# EAGLE design 4550 BOARD 1 (EAGLE 5.08)
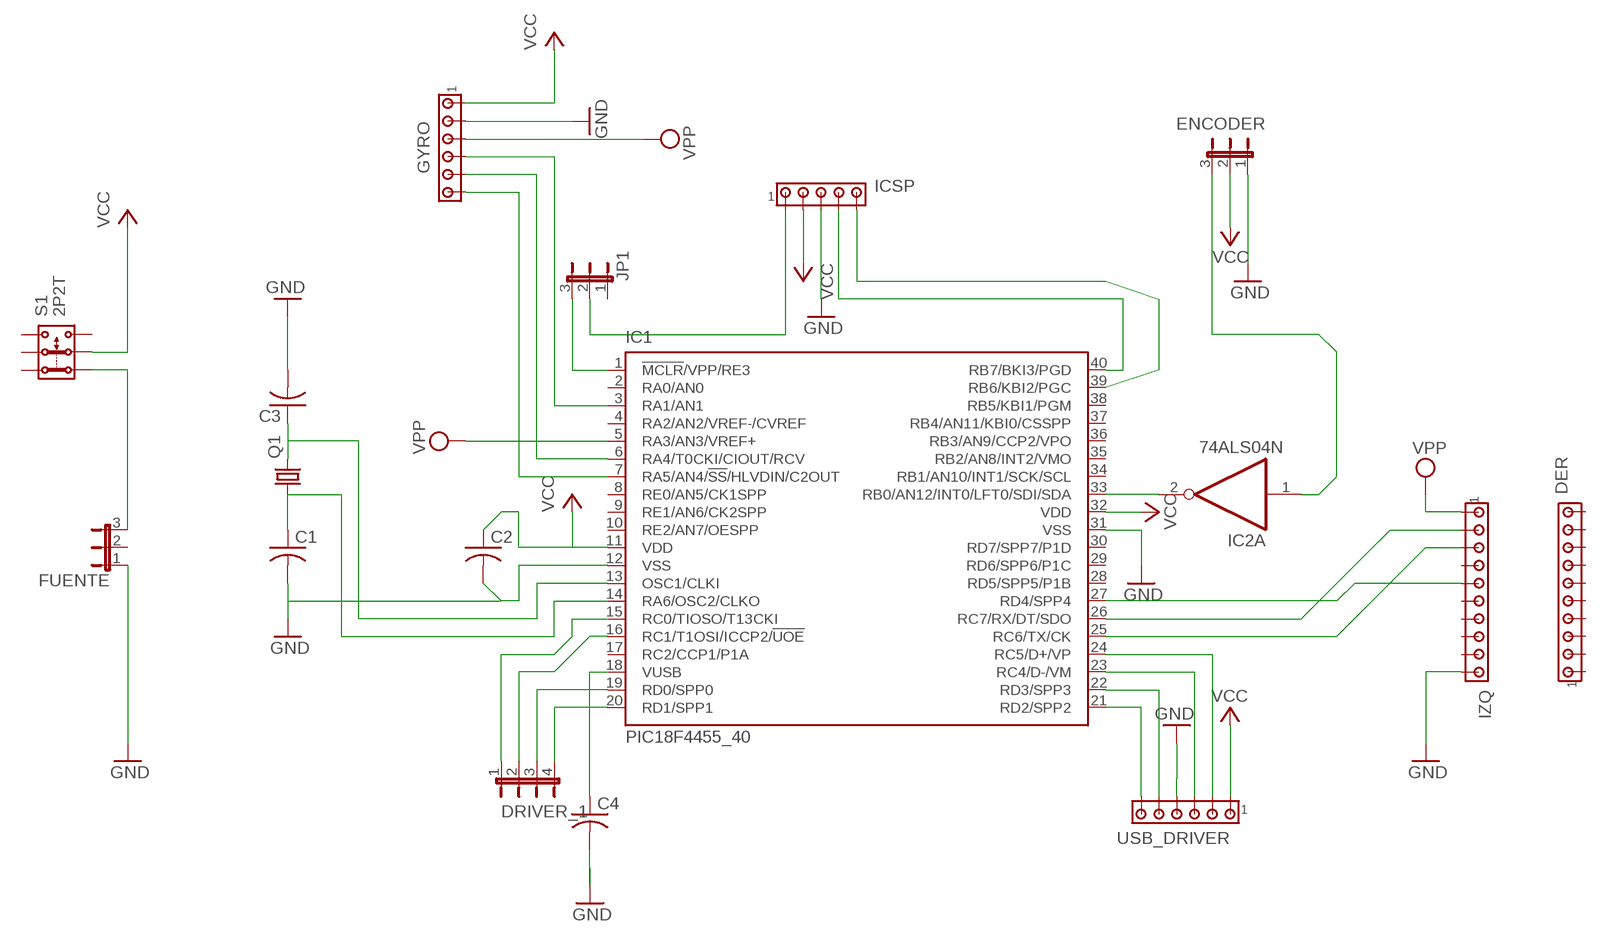
[diagram p0: schematic, sheet 1]

## Parts
C1  C-US025-024X044  [C025-024X044]
C2  C-US025-024X044  [C025-024X044]
C3  C-US025-024X044  [C025-024X044]
C4  C-US025-024X044  [C025-024X044]
DER  MTA10-100  [10X10MTA]
DRIVER_1  JP4E  [JP4]
ENCODER  JP2E  [JP2]
FUENTE  JP2E  [JP2]
GYRO  MTA06-100  [10X06MTA]
IC1  PIC18F4455_40  [DIL40]
IC2  74ALS04N  [DIL14]
ICSP  MTA05-100  [10X05MTA]
IZQ  MTA10-100  [10X10MTA]
JP1  JP2E  [JP2]
Q1  CRYSTALHC49S  [HC49/S]
S1  2P2T  [2P2T]
USB_DRIVER  MTA06-100  [10X06MTA]

## Nets
GND: C1.2 C2.2 C3.2 C4.2 ENCODER.1 FUENTE.1 GYRO.5 IC1.12(VSS) IC1.31(VSS) ICSP.3 IZQ.10 USB_DRIVER.3
N$1: FUENTE.3 S1.1.2
N$2: C3.1 IC1.13(OSC1/CLKI) Q1.2
N$3: C1.1 IC1.14(RA6/OSC2/CLKO) Q1.1
N$7: GYRO.3 IC1.3(RA1/AN1)
N$8: GYRO.2 IC1.6(RA4/T0CKI/CIOUT/RCV)
N$9: GYRO.1 IC1.7(RA5/AN4/!SS!/HLVDIN/C2OUT)
N$10: IC1.1(!MCLR!/VPP/RE3) JP1.3
N$11: ICSP.1 JP1.2
N$12: IC1.40(RB7/BKI3/PGD) ICSP.4
N$13: IC1.39(RB6/KBI2/PGC) ICSP.5
N$14: IC1.33(RB0/AN12/INT0/LFT0/SDI/SDA) IC2.2(A:O)
N$15: ENCODER.3 IC2.1(A:I)
N$16: DRIVER_1.1 IC1.15(RC0/TIOSO/T13CKI)
N$17: DRIVER_1.2 IC1.16(RC1/T1OSI/ICCP2/!UOE)
N$18: DRIVER_1.3 IC1.19(RD0/SPP0)
N$19: DRIVER_1.4 IC1.20(RD1/SPP1)
N$20: C4.1 IC1.18(VUSB)
N$21: IC1.21(RD2/SPP2) USB_DRIVER.1
N$22: IC1.22(RD3/SPP3) USB_DRIVER.2
N$23: IC1.23(RC4/D-/VM) USB_DRIVER.4
N$24: IC1.24(RC5/D+/VP) USB_DRIVER.5
N$25: IC1.26(RC7/RX/DT/SDO) IZQ.2
N$26: IC1.25(RC6/TX/CK) IZQ.3
N$27: IC1.27(RD4/SPP4) IZQ.5
VCC: C2.1 ENCODER.2 GYRO.6 IC1.11(VDD) IC1.32(VDD) ICSP.2 S1.2.2 USB_DRIVER.6
VPP: GYRO.4 IC1.5(RA3/AN3/VREF+) IZQ.1
Unconnected: DER.1 DER.2 DER.3 DER.4 DER.5 DER.6 DER.7 DER.8 DER.9 DER.10 FUENTE.2 IC1.2(RA0/AN0) IC1.4(RA2/AN2/VREF-/CVREF) IC1.8(RE0/AN5/CK1SPP) IC1.9(RE1/AN6/CK2SPP) IC1.10(RE2/AN7/OESPP) IC1.17(RC2/CCP1/P1A) IC1.28(RD5/SPP5/P1B) IC1.29(RD6/SPP6/P1C) IC1.30(RD7/SPP7/P1D) IC1.34(RB1/AN10/INT1/SCK/SCL) IC1.35(RB2/AN8/INT2/VMO) IC1.36(RB3/AN9/CCP2/VPO) IC1.37(RB4/AN11/KBI0/CSSPP) IC1.38(RB5/KBI1/PGM) IC2.3(B:I) IC2.4(B:O) IC2.5(C:I) IC2.6(C:O) IC2.8(D:O) IC2.9(D:I) IC2.10(E:O) IC2.11(E:I) IC2.12(F:O) IC2.13(F:I) IZQ.4 IZQ.6 IZQ.7 IZQ.8 IZQ.9 JP1.1 S1.1.1 S1.2.1 S1.3.1 S1.3.2

## Power pins joined to a net without a drawn wire
GND: IC2.7(P:GND)
VCC: IC2.14(P:VCC)

## Library data of the parts
C1-C4 = rcl:C-US: CAPACITOR, American symbol
DER IZQ = con-amp:MTA10-100: AMP connector
DRIVER_1 = jumper:JP4E: JUMPER
ENCODER FUENTE JP1 = jumper:JP2E: JUMPER
GYRO USB_DRIVER = con-amp:MTA06-100: AMP connector
IC1 = microchip:PIC18F4*_40: USB Microcontrollers with nanoWatt Technology High-Performance, Enhanced Flash, 28/40/44-Pin, Source: http://ww1.microchip.com/downloads/en/devicedoc/39632c.pdf
IC2 = 74xx-eu:74*04: Hex INVERTER
ICSP = con-amp:MTA05-100: AMP connector
Q1 = crystal:CRYSTAL: CRYSTAL
S1 = switch:2P2T: SLIDE SWITCH 2P2T Part No. SS-22F05-G(A)4 Source: CANAL ELECTRONIC CO., LTD .. switsch.pdf

## Board
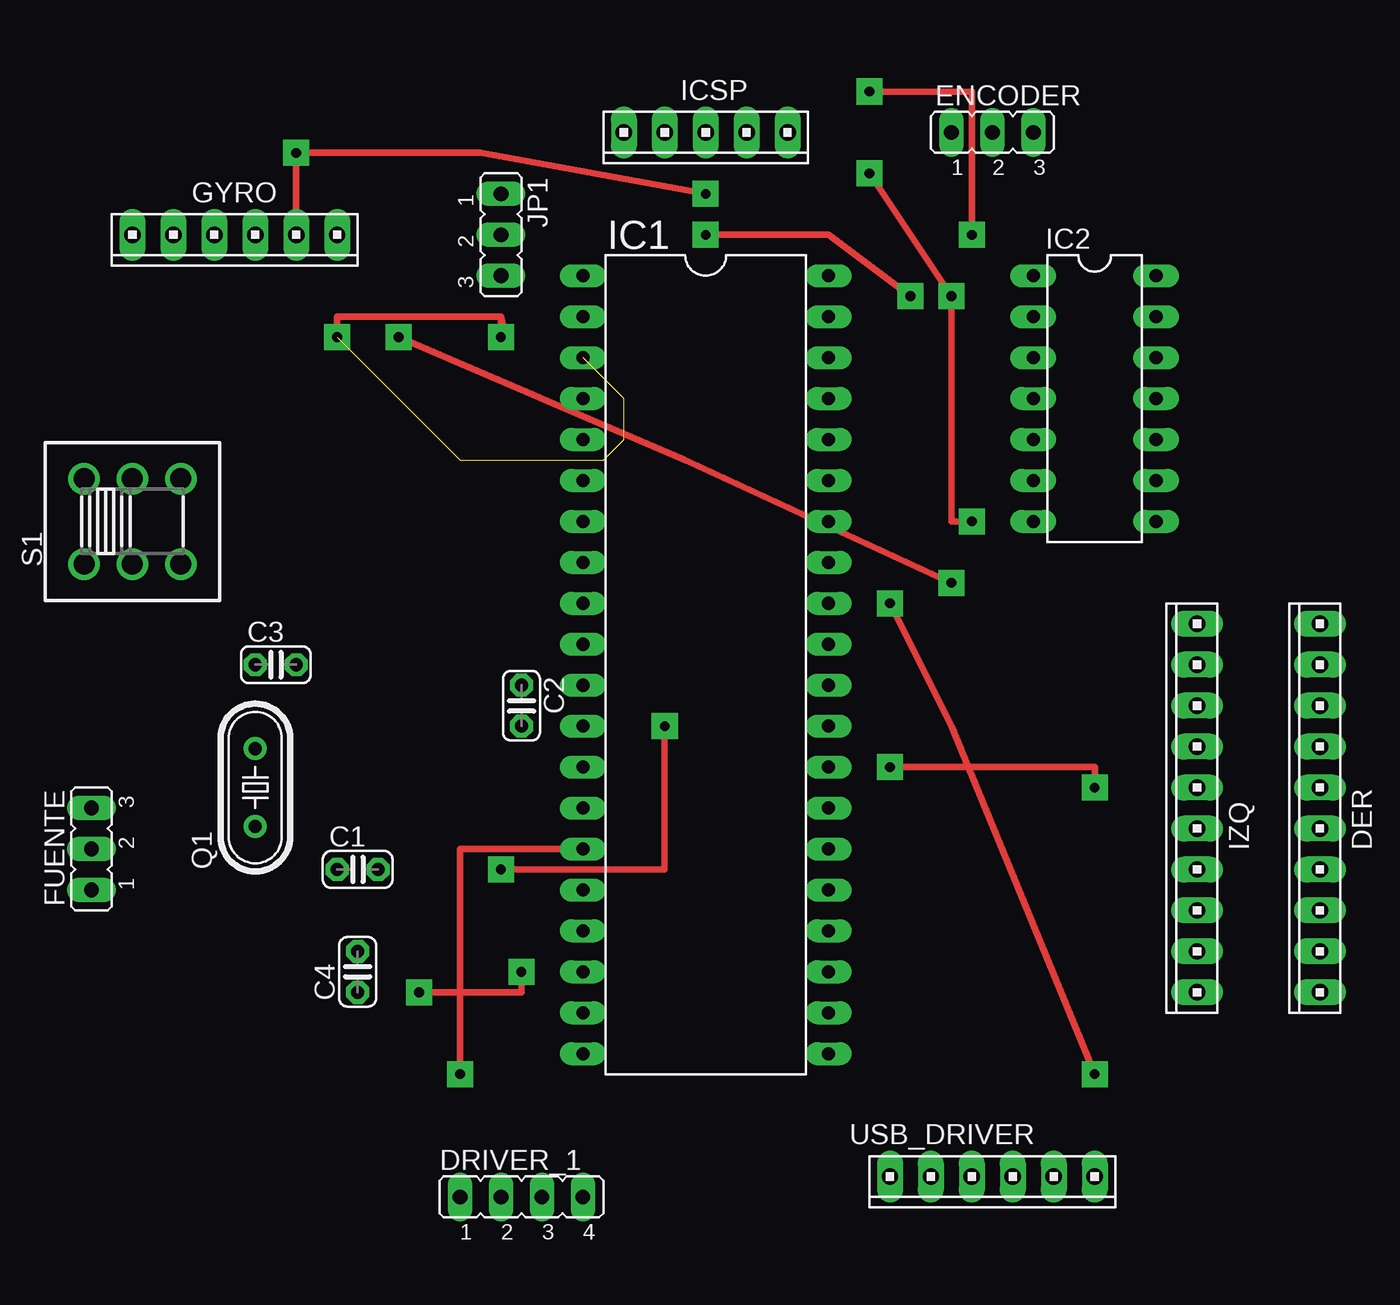
[diagram p1: board, top side]
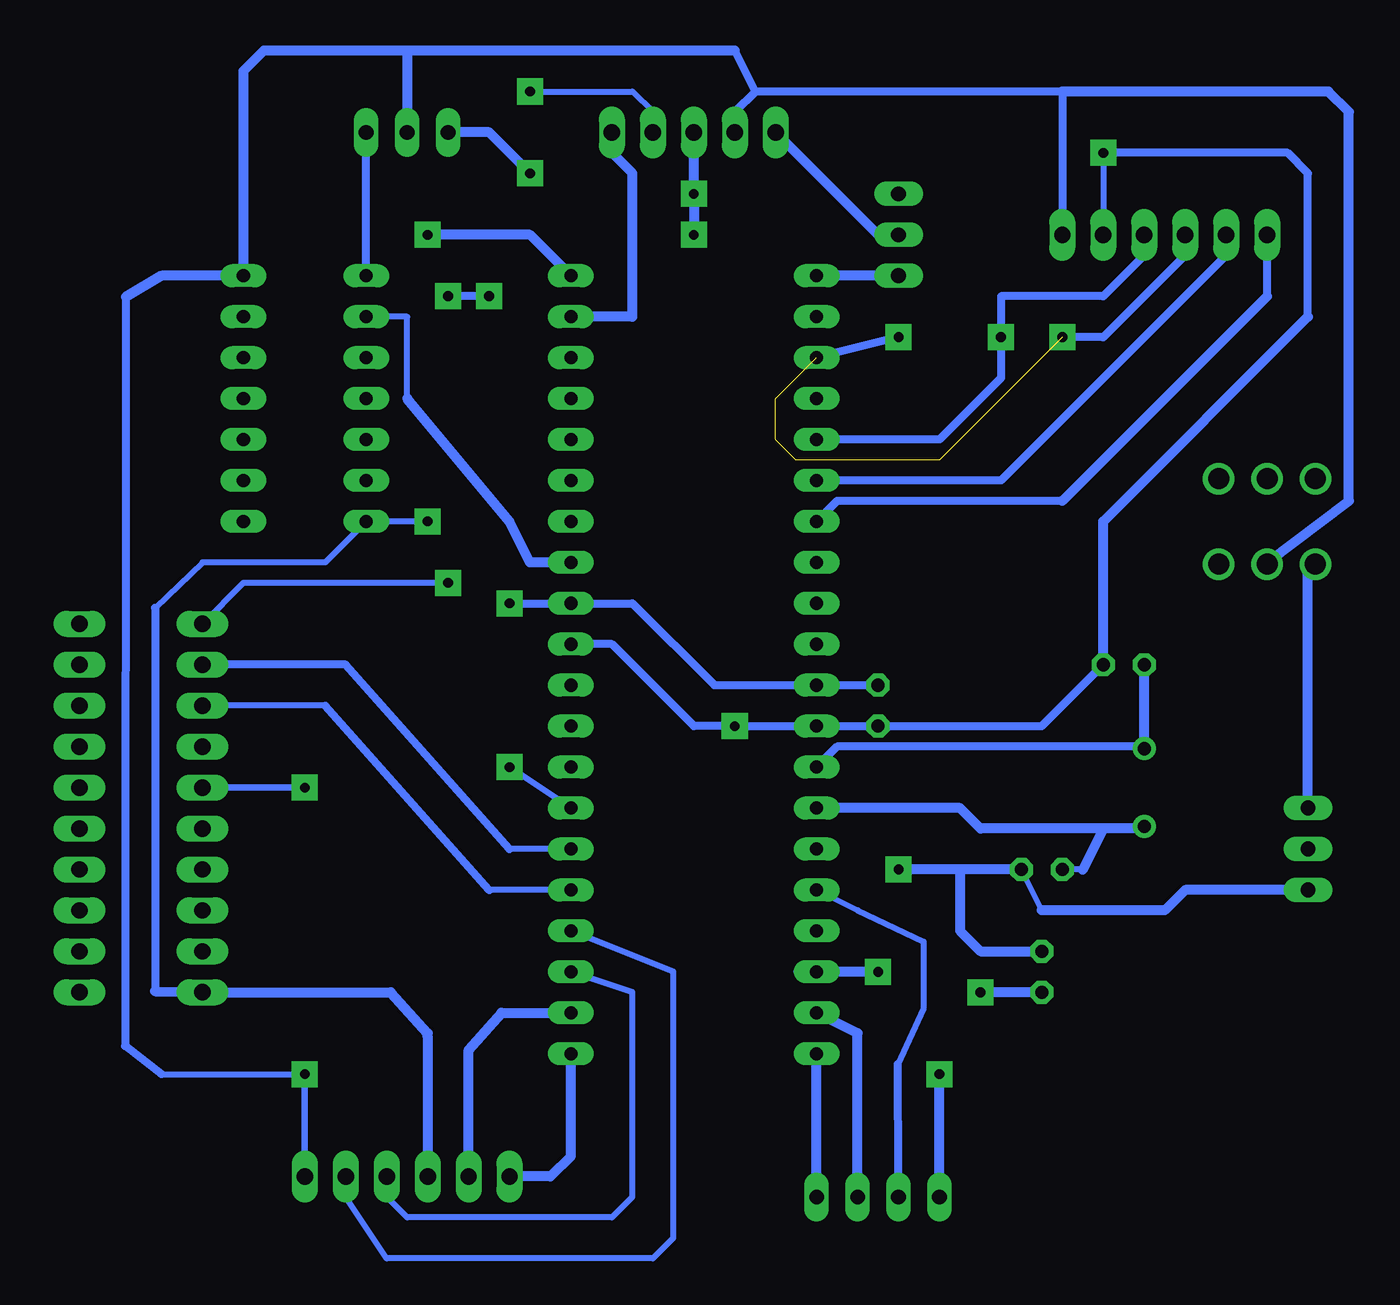
[diagram p2: board, bottom side, seen from below]

No outline drawn. Coordinates in mm, seen from the top.
Copper layers (1*16): Top 0.035mm / dielectric 1.5mm / Bottom 0.035mm
Design rules "Pcb close *": minimum track width 20mil, minimum drill 24mil, track to track 15mil, track to pad 12mil, pad to pad 12mil, via to via 8mil, smd to smd 8mil, copper to edge 40mil, drill to drill 8mil, minimum pad ring 12mil, minimum via ring 20mil, stop-mask expansion 4mil, vias tented up to drill 0mil, thermal gap 10mil

### Footprints (pad centres in the part's own frame; a part is rotated, then mirrored left to right if it is on the bottom)
C025-024X044 = drill 0.813 octagon: 1 -1.27,0; 2 1.27,0
10X10MTA = drill 1.016 long: 1 11.43,0; 2 8.89,0; 3 6.35,0; 4 3.81,0; 5 1.27,0; 6 -1.27,0; 7 -3.81,0; 8 -6.35,0; 9 -8.89,0; 10 -11.43,0
JP4 = drill 0.914 long: 1 -3.81,0; 2 -1.27,0; 3 1.27,0; 4 3.81,0
JP2 = drill 0.914 long: 1 -2.54,0; 2 0,0; 3 2.54,0
10X06MTA = drill 1.016 long: 1 6.35,0; 2 3.81,0; 3 1.27,0; 4 -1.27,0; 5 -3.81,0; 6 -6.35,0
DIL40 = drill 0.813 long: 1 -24.13,-7.62; 2 -21.59,-7.62; 3 -19.05,-7.62; 4 -16.51,-7.62; 5 -13.97,-7.62; 6 -11.43,-7.62; 7 -8.89,-7.62; 8 -6.35,-7.62; 9 -3.81,-7.62; 10 -1.27,-7.62; 11 1.27,-7.62; 12 3.81,-7.62; 13 6.35,-7.62; 14 8.89,-7.62; 15 11.43,-7.62; 16 13.97,-7.62; 17 16.51,-7.62; 18 19.05,-7.62; 19 21.59,-7.62; 20 24.13,-7.62; 21 24.13,7.62; 22 21.59,7.62; 23 19.05,7.62; 24 16.51,7.62; 25 13.97,7.62; 26 11.43,7.62; 27 8.89,7.62; 28 6.35,7.62; 29 3.81,7.62; 30 1.27,7.62; 31 -1.27,7.62; 32 -3.81,7.62; 33 -6.35,7.62; 34 -8.89,7.62; 35 -11.43,7.62; 36 -13.97,7.62; 37 -16.51,7.62; 38 -19.05,7.62; 39 -21.59,7.62; 40 -24.13,7.62
DIL14 = drill 0.813 long: 1 -7.62,-3.81; 2 -5.08,-3.81; 3 -2.54,-3.81; 4 0,-3.81; 5 2.54,-3.81; 6 5.08,-3.81; 7 7.62,-3.81; 8 7.62,3.81; 9 5.08,3.81; 10 2.54,3.81; 11 0,3.81; 12 -2.54,3.81; 13 -5.08,3.81; 14 -7.62,3.81
10X05MTA = drill 1.016 long: 1 5.08,0; 2 2.54,0; 3 0,0; 4 -2.54,0; 5 -5.08,0
HC49/S = drill 0.813 round: 1 -2.413,0; 2 2.413,0
2P2T = drill 1.3 pad 1.93 round: 1.1 -3,2.65; 1.2 -3,-2.65; 2.1 0,2.65; 2.2 0,-2.65; 3.1 3,2.65; 3.2 3,-2.65

### Placement (x,y rotation side)
C1  41.91,24.13 0 top
C2  52.07,34.29 270 top
C3  36.83,36.83 0 top
C4  41.91,17.78 90 top
DER  101.6,27.94 90 top
DRIVER_1  52.07,3.81 0 top
ENCODER  81.28,69.85 0 top
FUENTE  25.4,25.4 90 top
GYRO  34.29,63.5 180 top
IC1  63.5,36.83 270 top
IC2  87.63,53.34 270 top
ICSP  63.5,69.85 180 top
IZQ  93.98,27.94 90 top
JP1  50.8,63.5 270 top
Q1  35.56,29.21 90 top
S1  27.94,45.72 0 top
USB_DRIVER  81.28,5.08 180 top

### Tracks (layer width: path | path; a pad name or v marks a point on that pad's centre or on a via)
GND  (via drill 0.6)
  Top 0.406: GYRO.5 v38.1,68.58 49.53,68.58 v63.5,66.04 | v63.5,63.5 71.12,63.5 v76.2,59.69 | v73.66,67.31 v78.74,59.69 78.74,45.72 v80.01,45.72 | v50.8,24.13 60.96,24.13 v60.96,33.02
  Bottom 0.381: 41.91,21.59 C1.2 | 96.91,40.35 93.98,43.18 86.36,43.18 IC2.7 v80.01,45.72 | v38.1,68.58 GYRO.5
  Bottom 0.508: C3.2 41.91,33.02 C2.2 IC1.12 v60.96,33.02 63.5,33.02 68.58,38.1 IC1.31 | 96.91,40.35 96.91,16.58 | v76.2,59.69 v78.74,59.69 | 25.4,58.42 25.4,67.31 26.67,68.58 v38.1,68.58
  Bottom 0.61: C4.2 45.72,19.05 46.99,20.32 46.99,24.13 | C1.2 46.99,24.13 | 46.99,24.13 v50.8,24.13 | FUENTE.1 33.02,22.86 34.29,21.59 41.91,21.59 | ICSP.3 v63.5,66.04 v63.5,63.5 | 96.91,16.58 IZQ.10 82.3,16.51 80.01,13.97 80.01,13.72 USB_DRIVER.3 | v73.66,67.31 76.2,69.85 ENCODER.1 | C3.2 38.1,45.72 25.4,58.42
N$1
  Bottom 0.381: 25.4,43.18 S1.1.2
  Bottom 0.61: FUENTE.3 25.4,43.18
N$2
  Bottom 0.381: Q1.2 35.56,31.75
  Bottom 0.508: IC1.13 54.61,31.75 35.56,31.75
  Bottom 0.61: 35.56,31.75 C3.1
N$3
  Bottom 0.381: 39.37,24.13 C1.1 | Q1.1 35.56,26.67
  Bottom 0.61: 38.1,26.67 39.37,24.13 | 35.56,26.67 38.1,26.67 | IC1.14 46.99,27.94 45.72,26.67 38.1,26.67
N$4  (via drill 0.6)
  other vias: 74.93,30.48
N$5  (via drill 0.6)
  other vias: 87.63,29.21
N$6  (via drill 0.6)
  other vias: 48.26,11.43
N$7  (via drill 0.6)  (5 unrouted)
  Top 0.406: v40.64,57.15 40.64,58.42 50.8,58.42 | 50.8,58.42 51.1,57.15 51.1,57.08 50.8,57.08 50.8,58.42
  Bottom 0.508: 50.8,57.15 IC1.3 | v40.64,57.15 38.1,57.15 33.02,62.23 GYRO.3
N$8
  Bottom 0.508: GYRO.2 30.48,62.23 44.45,48.26 IC1.6
N$9
  Bottom 0.508: IC1.7 54.61,46.99 40.64,46.99 | 27.94,59.69 GYRO.1
  Bottom 0.61: 27.94,59.69 40.64,46.99
N$10
  Bottom 0.61: JP1.3 IC1.1
N$11
  Bottom 0.381: JP1.2 52.07,63.5
  Bottom 0.61: 52.07,63.5 ICSP.1
N$12  (via drill 0.6)
  Top 0.406: v73.66,72.39 80.01,72.39 v80.01,63.5
  Bottom 0.381: v73.66,72.39 67.31,72.39 66.04,71.12 ICSP.4
  Bottom 0.61: IC1.40 73.66,63.5 v80.01,63.5
N$13
  Bottom 0.381: 68.58,68.58 ICSP.5
  Bottom 0.61: IC1.39 67.31,58.42 67.31,67.31 68.58,68.58
N$14
  Bottom 0.381: 81.28,53.34 81.28,58.42 IC2.2
  Bottom 0.61: IC1.33 73.66,43.18 74.93,45.72 81.28,53.34
N$15
  Bottom 0.508: IC2.1 ENCODER.3
N$16  (via drill 0.6)
  Top 0.406: v48.26,11.43 48.26,25.4 IC1.15
  Bottom 0.61: DRIVER_1.1 v48.26,11.43
N$17
  Bottom 0.381: IC1.16 53.34,21.59 49.23,19.65 arc90 49.23,19.64 49.23,15.55 50.84,12.05 | DRIVER_1.2 50.8,5.08
  Bottom 0.508: 50.8,5.08 50.84,12.05
N$18
  Bottom 0.61: IC1.19 53.34,13.97 DRIVER_1.3
N$19
  Bottom 0.61: DRIVER_1.4 IC1.20
N$20  (via drill 0.6)
  Top 0.406: v45.72,16.51 52.07,16.51 v52.07,17.78
  Bottom 0.381: IC1.18 57.15,17.78
  Bottom 0.61: C4.1 v45.72,16.51 | v52.07,17.78 IC1.18
N$21
  Bottom 0.61: IC1.21 71.12,6.35 72.39,5.08 USB_DRIVER.1
N$22
  Bottom 0.61: IC1.22 75.44,15.24 77.47,12.95 USB_DRIVER.2
N$23
  Bottom 0.381: IC1.23 67.31,16.51 67.31,3.81 68.58,2.54 81.28,2.54 82.55,3.81 USB_DRIVER.4
N$24
  Bottom 0.381: IC1.24 64.77,17.78 64.77,1.27 66.04,0 82.55,0 85.09,3.81 USB_DRIVER.5
N$25
  Bottom 0.381: IC1.26 74.93,25.4
  Bottom 0.508: 74.93,25.4 85.09,36.83 IZQ.2
N$26
  Bottom 0.381: IC1.25 76.2,22.86 | 86.36,34.29 IZQ.3
  Bottom 0.508: 76.2,22.86 86.36,34.29
N$27  (via drill 0.6)
  Top 0.406: v74.93,30.48 87.63,30.48 v87.63,29.21
  Bottom 0.381: IZQ.5 92.71,29.21
  Bottom 0.406: IC1.27 v74.93,30.48 | v87.63,29.21 IZQ.5
N$28  (via drill 0.6)
  other vias: 50.8,57.15
VCC  (via drill 0.6)
  Top 0.406: v74.93,40.64 78.74,33.02 v87.63,11.43
  Bottom 0.381: 60.96,71.12 ICSP.2 | 96.52,11.43 v87.63,11.43 | USB_DRIVER.6 87.63,3.81
  Bottom 0.406: v87.63,11.43 USB_DRIVER.6
  Bottom 0.508: 59.69,72.39 40.64,72.39 GYRO.6 | 59.69,72.39 60.96,71.12 | C2.1 IC1.11 62.23,35.56 67.31,40.64 IC1.32 v74.93,40.64 | 98.73,59.65 98.78,13.17 96.52,11.43 | 59.69,72.39 60.96,74.93
  Bottom 0.559: S1.2.2 27.94,43.18
  Bottom 0.61: 81.28,74.93 ENCODER.2 | IC2.14 96.52,60.96 98.73,59.65
  Bottom 0.635: 27.94,43.18 22.86,46.99 22.86,71.12 24.13,72.39 40.64,72.39 | IC2.14 91.44,73.66 90.17,74.93 81.28,74.93 60.96,74.93
VPP  (via drill 0.6)
  Top 0.406: v44.45,57.15 62.23,49.53 v78.74,41.91
  Bottom 0.381: IZQ.1 91.44,41.91 v78.74,41.91
  Bottom 0.508: IC1.5 48.26,50.8 44.45,54.61 v44.45,57.15 44.45,59.69 38.1,59.69 35.56,62.23 GYRO.4